# EAGLE design AX-03r (EAGLE 7.5.0)
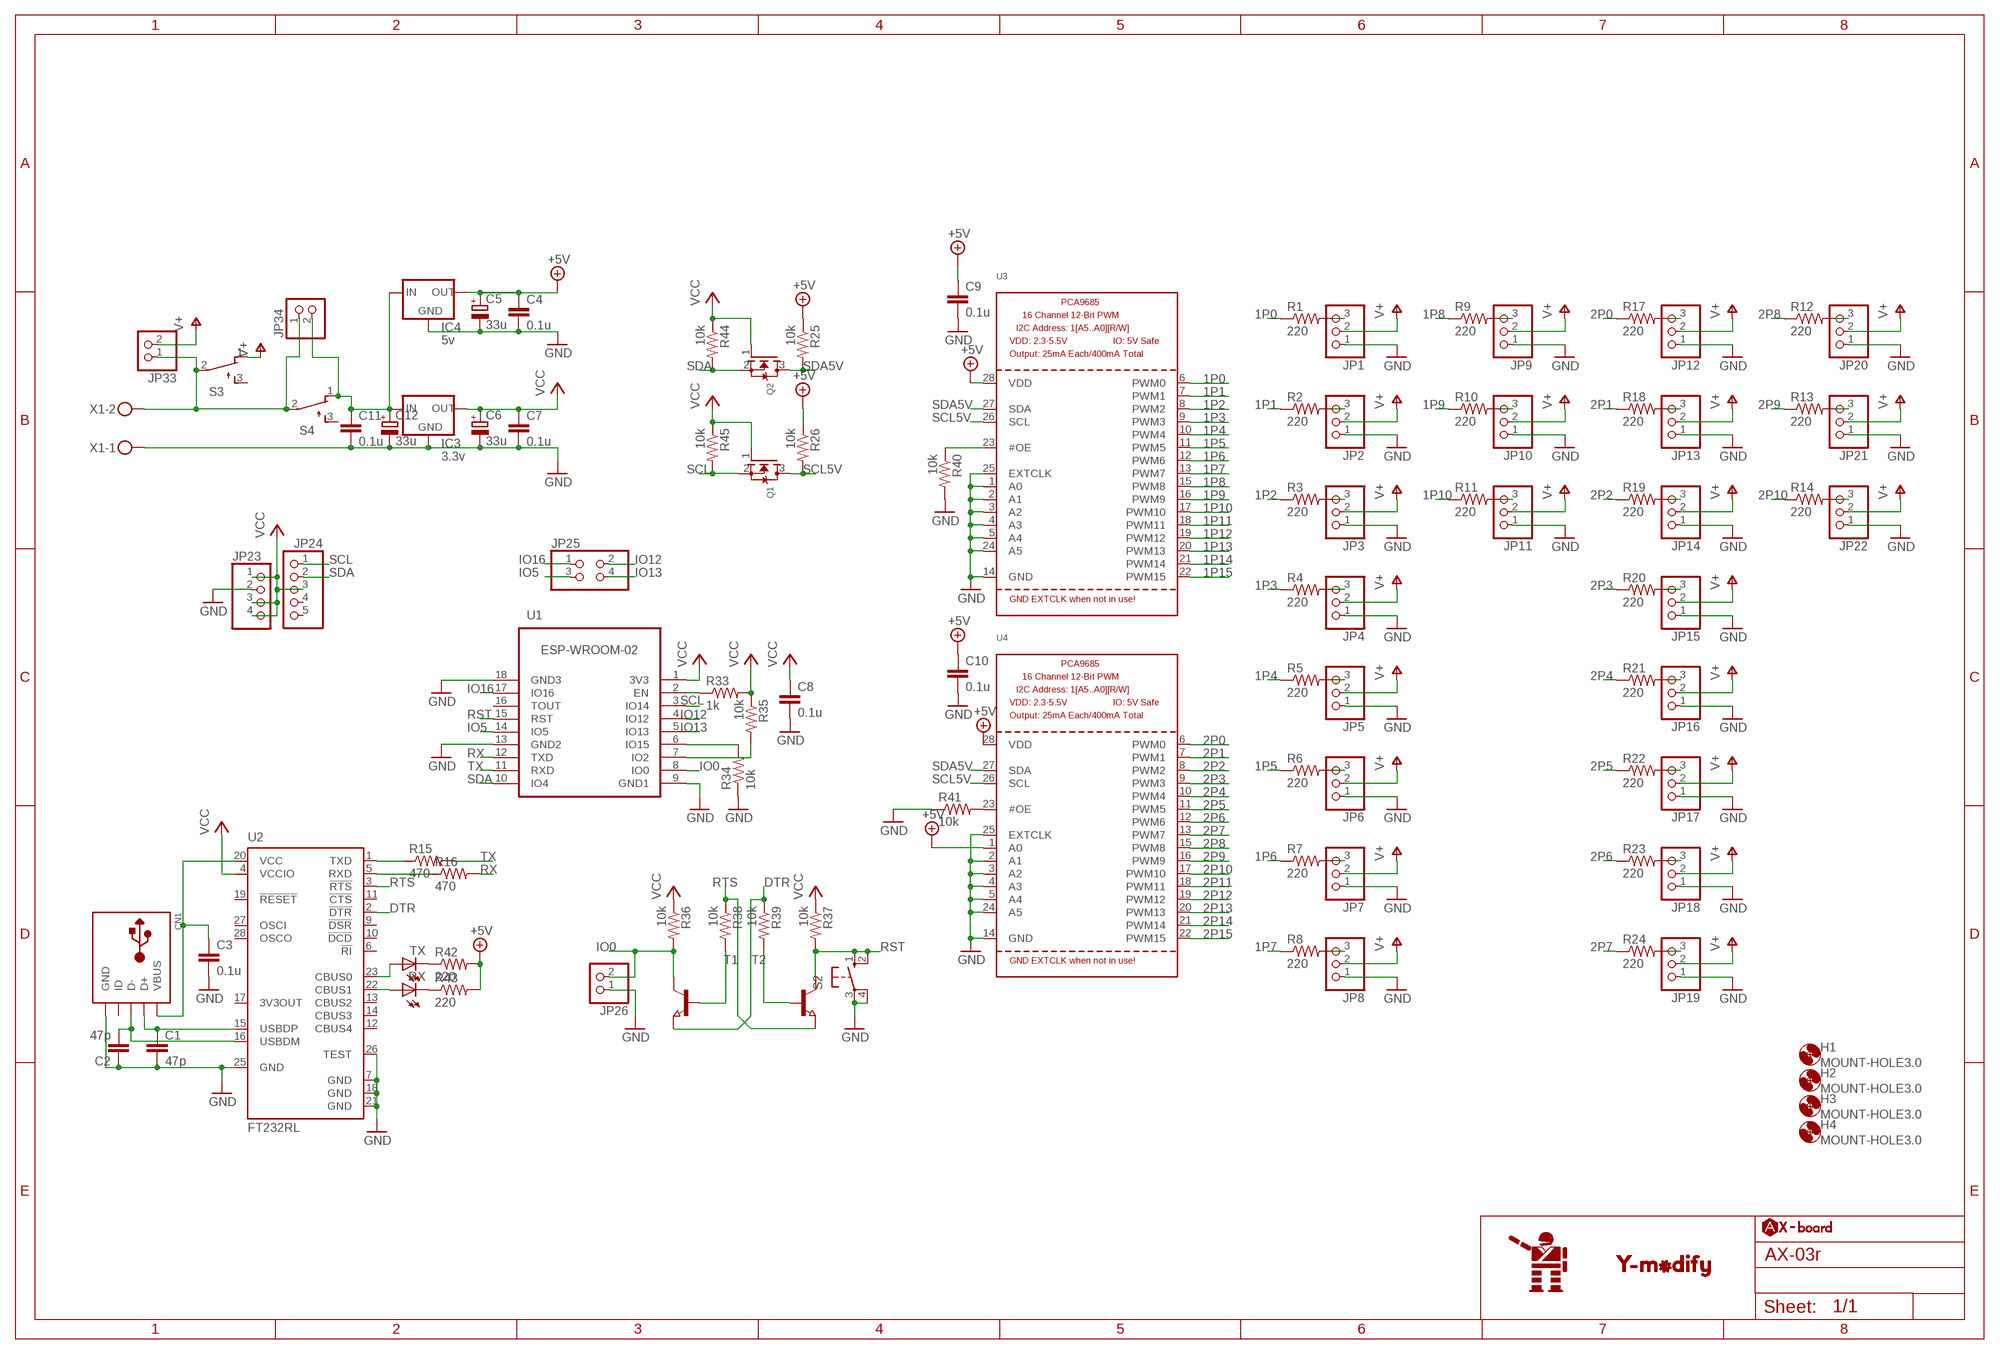
[diagram p0: schematic, sheet 1]

## Parts
C1  47p  C-EU025-025X050  [C025-025X050]
C2  47p  C-EU025-025X050  [C025-025X050]
C3  0.1u  C-EU025-025X050  [C025-025X050]
C4  0.1u  C-EU025-025X050  [C025-025X050]
C5  33u  CPOL-EUE2,5-6E  [E2,5-6E]
C6  33u  CPOL-EUE2,5-6E  [E2,5-6E]
C7  0.1u  C-EU025-025X050  [C025-025X050]
C8  0.1u  C-EU025-025X050  [C025-025X050]
C9  0.1u  C-EU025-025X050  [C025-025X050]
C10  0.1u  C-EU025-025X050  [C025-025X050]
C11  0.1u  C-EU025-025X050  [C025-025X050]
C12  33u  CPOL-EUE2,5-6E  [E2,5-6E]
CN1  USBTHM  [USB-MINIB-THM]
H1  MOUNT-HOLE3.0  [3,0]
H2  MOUNT-HOLE3.0  [3,0]
H3  MOUNT-HOLE3.0  [3,0]
H4  MOUNT-HOLE3.0  [3,0]
IC3  3.3v  78XXS  [78XXS]
IC4  5v  78XXS  [78XXS]
JP1  PINHD-1X3  [1X03]
JP2  PINHD-1X3  [1X03]
JP3  PINHD-1X3  [1X03]
JP4  PINHD-1X3  [1X03]
JP5  PINHD-1X3  [1X03]
JP6  PINHD-1X3  [1X03]
JP7  PINHD-1X3  [1X03]
JP8  PINHD-1X3  [1X03]
JP9  PINHD-1X3  [1X03]
JP10  PINHD-1X3  [1X03]
JP11  PINHD-1X3  [1X03]
JP12  PINHD-1X3  [1X03]
JP13  PINHD-1X3  [1X03]
JP14  PINHD-1X3  [1X03]
JP15  PINHD-1X3  [1X03]
JP16  PINHD-1X3  [1X03]
JP17  PINHD-1X3  [1X03]
JP18  PINHD-1X3  [1X03]
JP19  PINHD-1X3  [1X03]
JP20  PINHD-1X3  [1X03]
JP21  PINHD-1X3  [1X03]
JP22  PINHD-1X3  [1X03]
JP23  PINHD-1X4  [1X04]
JP24  PINHD-1X5  [1X05]
JP25  PINHD-2X2  [2X02]
JP26  PINHD-1X2  [1X02]
JP33  PINHD-1X2  [1X02]
JP34  PINHD-1X2  [1X02]
M1  MON  [MON]
M2  Y-MODIFY  [Y-MODIFY]
M3  AXBOARD  [AXBOARD]
Q1  MOSFET-NWAVE  [SOT23-W]
Q2  MOSFET-NWAVE  [SOT23-W]
R1  220  R-US_0204/2V  [0204V]
R2  220  R-US_0204/2V  [0204V]
R3  220  R-US_0204/2V  [0204V]
R4  220  R-US_0204/2V  [0204V]
R5  220  R-US_0204/2V  [0204V]
R6  220  R-US_0204/2V  [0204V]
R7  220  R-US_0204/2V  [0204V]
R8  220  R-US_0204/2V  [0204V]
R9  220  R-US_0204/2V  [0204V]
R10  220  R-US_0204/2V  [0204V]
R11  220  R-US_0204/2V  [0204V]
R12  220  R-US_0204/2V  [0204V]
R13  220  R-US_0204/2V  [0204V]
R14  220  R-US_0204/2V  [0204V]
R15  470  R-US_0204/2V  [0204V]
R16  470  R-US_0204/2V  [0204V]
R17  220  R-US_0204/2V  [0204V]
R18  220  R-US_0204/2V  [0204V]
R19  220  R-US_0204/2V  [0204V]
R20  220  R-US_0204/2V  [0204V]
R21  220  R-US_0204/2V  [0204V]
R22  220  R-US_0204/2V  [0204V]
R23  220  R-US_0204/2V  [0204V]
R24  220  R-US_0204/2V  [0204V]
R25  10k  R-US_0204/2V  [0204V]
R26  10k  R-US_0204/2V  [0204V]
R33  1k  R-US_0204/2V  [0204V]
R34  10k  R-US_0204/2V  [0204V]
R35  10k  R-US_0204/2V  [0204V]
R36  10k  R-US_0204/2V  [0204V]
R37  10k  R-US_0204/2V  [0204V]
R38  10k  R-US_0204/2V  [0204V]
R39  10k  R-US_0204/2V  [0204V]
R40  10k  R-US_0204/2V  [0204V]
R41  10k  R-US_0204/2V  [0204V]
R42  220  R-US_0204/2V  [0204V]
R43  220  R-US_0204/2V  [0204V]
R44  10k  R-US_0204/2V  [0204V]
R45  10k  R-US_0204/2V  [0204V]
RX  LED3MM  [LED3MM]
S2  10-XX  [B3F-10XX]
S3  TL32PO  [TL3XPO]
S4  TL32PO  [TL3XPO]
T1  NPN-TRANSISTOR_SOT23  [SOT23]
T2  NPN-TRANSISTOR_SOT23  [SOT23]
TX  LED3MM  [LED3MM]
U1  ESP-WROOM-02  ESP-WROOM-02FRONT-FACE  [FRONT-FACE]
U2  FT232RL  [SSOP28]
U3  PCA9685  [TSSOP28]
U4  PCA9685  [TSSOP28]
X1  MKDSN1,5/2-5,08  [MKDSN1,5/2-5,08]

## Nets
1P0: R1.1 U3.6(PWM0)
1P1: R2.1 U3.7(PWM1)
1P2: R3.1 U3.8(PWM2)
1P3: R4.1 U3.9(PWM3)
1P4: R5.1 U3.10(PWM4)
1P5: R6.1 U3.11(PWM5)
1P6: R7.1 U3.12(PWM6)
1P7: R8.1 U3.13(PWM7)
1P8: R9.1 U3.15(PWM8)
1P9: R10.1 U3.16(PWM9)
1P10: R11.1 U3.17(PWM10)
1P11: U3.18(PWM11)
1P12: U3.19(PWM12)
1P13: U3.20(PWM13)
1P14: U3.21(PWM14)
1P15: U3.22(PWM15)
2P0: R17.1 U4.6(PWM0)
2P1: R18.1 U4.7(PWM1)
2P2: R19.1 U4.8(PWM2)
2P3: R20.1 U4.9(PWM3)
2P4: R21.1 U4.10(PWM4)
2P5: R22.1 U4.11(PWM5)
2P6: R23.1 U4.12(PWM6)
2P7: R24.1 U4.13(PWM7)
2P8: R12.1 U4.15(PWM8)
2P9: R13.1 U4.16(PWM9)
2P10: R14.1 U4.17(PWM10)
2P11: U4.18(PWM11)
2P12: U4.19(PWM12)
2P13: U4.20(PWM13)
2P14: U4.21(PWM14)
2P15: U4.22(PWM15)
+5V: C4.1 C5.+ C9.1 C10.1 IC4.OUT R25.1 R26.1 R42.2 R43.2 U3.28(VDD) U4.1(A0) U4.28(VDD)
DTR: R39.1 T1.2(E) U2.2(!DTR)
GND: C1.2 C2.1 C3.2 C4.2 C5.- C6.- C7.2 C8.2 C9.2 C10.2 C11.2 C12.- CN1.GND IC3.GND IC4.GND JP1.1 JP2.1 JP3.1 JP4.1 JP5.1 JP6.1 JP7.1 JP8.1 JP9.1 JP10.1 JP11.1 JP12.1 JP13.1 JP14.1 JP15.1 JP16.1 JP17.1 JP18.1 JP19.1 JP20.1 JP21.1 JP22.1 JP23.2 JP26.1 R34.1 R40.2 R41.1 S2.3(P) S2.4(P1) U1.9(GND1) U1.13(GND2) U1.18(GND3) U2.7(GND) U2.18(GND) U2.21(GND) U2.25(GND) U2.26(TEST) U3.1(A0) U3.2(A1) U3.3(A2) U3.4(A3) U3.5(A4) U3.14(GND) U3.24(A5) U3.25(EXTCLK) U4.2(A1) U4.3(A2) U4.4(A3) U4.5(A4) U4.14(GND) U4.24(A5) U4.25(EXTCLK) X1.1
IO0: JP26.2 R36.2 T1.3(C) U1.8(IO0)
IO5: JP25.3 U1.14(IO5)
IO12: JP25.2 U1.4(IO12)
IO13: JP25.4 U1.5(IO13)
IO16: JP25.1 U1.17(IO16)
N$1: JP1.3 R1.2
N$2: R33.1 U1.2(EN)
N$3: JP2.3 R2.2
N$4: R34.2 U1.6(IO15)
N$5: JP3.3 R3.2
N$6: R35.2 U1.7(IO2)
N$7: JP4.3 R4.2
N$8: R41.2 U4.23(#OE)
N$9: JP5.3 R5.2
N$10: R40.1 U3.23(#OE)
N$11: JP6.3 R6.2
N$12: R38.2 T1.1(B)
N$13: JP7.3 R7.2
N$14: R39.2 T2.1(B)
N$15: JP8.3 R8.2
N$16: C1.1 CN1.D+ U2.15(USBDP)
N$17: JP9.3 R9.2
N$18: JP10.3 R10.2
N$19: JP11.3 R11.2
N$20: JP20.3 R12.2
N$21: JP21.3 R13.2
N$22: JP22.3 R14.2
N$25: C2.2 CN1.D- U2.16(USBDM)
N$26: JP12.3 R17.2
N$27: JP13.3 R18.2
N$28: JP14.3 R19.2
N$29: JP15.3 R20.2
N$30: JP16.3 R21.2
N$31: JP17.3 R22.2
N$32: JP18.3 R23.2
N$33: JP19.3 R24.2
N$34: C3.1 CN1.VBUS U2.20(VCC)
N$43: R42.1 TX.K(C)
N$44: R43.1 RX.K(C)
N$45: TX.A U2.23(CBUS0)
N$46: RX.A U2.22(CBUS1)
N$48: JP33.1 JP34.1 S3.2(P) S4.2(P) X1.2
N$49: C11.1 C12.+ IC3.IN IC4.IN JP34.2 S4.1(O)
N$50: R15.1 U2.1(TXD)
N$51: R16.1 U2.5(RXD)
RST: R37.2 S2.1(S) S2.2(S1) T2.3(C) U1.15(RST)
RTS: R38.1 T2.2(E) U2.3(!RTS)
RX: R16.2 U1.12(TXD)
SCL: JP24.1 Q1.2(S) R45.2 U1.3(IO14)
SCL5V: Q1.3(D) R26.2 U3.26(SCL) U4.26(SCL)
SDA: JP24.2 Q2.2(S) R44.2 U1.10(IO4)
SDA5V: Q2.3(D) R25.2 U3.27(SDA) U4.27(SDA)
TX: R15.2 U1.11(RXD)
V+: JP1.2 JP2.2 JP3.2 JP4.2 JP5.2 JP6.2 JP7.2 JP8.2 JP9.2 JP10.2 JP11.2 JP12.2 JP13.2 JP14.2 JP15.2 JP16.2 JP17.2 JP18.2 JP19.2 JP20.2 JP21.2 JP22.2 JP33.2 S3.1(O)
VCC: C6.+ C7.1 C8.1 IC3.OUT JP23.1 JP23.3 JP23.4 JP24.3 Q1.1(G) Q2.1(G) R33.2 R35.1 R36.1 R37.1 R44.1 R45.1 U1.1(3V3) U2.4(VCCIO)
Unconnected: CN1.ID JP24.4 JP24.5 S3.3(S) S4.3(S) U1.16(TOUT) U2.6(!RI) U2.9(!DSR) U2.10(!DCD) U2.11(!CTS) U2.12(CBUS4) U2.13(CBUS2) U2.14(CBUS3) U2.17(3V3OUT) U2.19(!RESET) U2.27(OSCI) U2.28(OSCO)

## Library data of the parts
C1-C4 C7-C11 = resistor:C-EU: CAPACITOR, European symbol
C5 C6 C12 = rcl:CPOL-EU: POLARIZED CAPACITOR, European symbol
CN1 = adafruit:USB: USB Connectors USBMINIB - Surface Mount Female Mini-B USB Connector 4UConnector: 06564 By microbuilder.eu Thru-hole RA Female Mini-B USB Connector 4UConnector: 18732 By ladyada.net
H1-H4 = holes:MOUNT-HOLE: MOUNTING HOLE with drill center marker
IC3 IC4 = v-reg:78XXS: VOLTAGE REGULATOR
JP1-JP22 = pinhead:PINHD-1X3: PIN HEADER
JP23 = pinhead:PINHD-1X4: PIN HEADER
JP24 = pinhead:PINHD-1X5: PIN HEADER
JP25 = pinhead:PINHD-2X2: PIN HEADER
JP26 JP33 JP34 = pinhead:PINHD-1X2: PIN HEADER
M1 = monchar:MON
M2 = y-modify_logo:Y-MODIFY
M3 = y-modify_logos:AXBOARD
Q1 Q2 = adafruit:MOSFET-N: N-Channel Mosfet 2N7002E - 60V 260mA SOT23 [Digikey: 2N7002ET1GOSTR-ND] - REEL BSH103 - 30V 850mA SOT23 [Digikey: 568-5013-1-ND]
R1-R26 R33-R45 = resistor:R-US_: RESISTOR, American symbol
RX TX = led:LED: LED OSRAM: - CHIPLED LG R971, LG N971, LY N971, LG Q971, LY Q971, LO R971, LY R971 LH N974, LH R974 LS Q976, LO Q976, LY Q976 LO Q996 - Hyper CHIPLED LW Q18S LB Q993, LB Q99A, LB R99A - SideLED LS A670, LO A670, LY A670, LG A670, LP A670 LB A673, LV A673, LT A673, LW A673 LH A674 LY A675 LS A676, LA A676, LO A676, LY A676, LW A676 LS A679, LY A679, LG A679 - Hyper Micro SIDELED® LS Y876, LA Y876, LO Y876, LY Y876 LT Y87S - SmartLED LW L88C, LW L88S LB L89C, LB L89S, LG L890 LS L89K, LO L89K, LY L89K LS L896, LA L896, LO L896, LY L896 - TOPLED LS T670, LO T670, LY T670, LG T670, LP T670 LSG T670, LSP T670, LSY T670, LOP T670, LYG T670 LG T671, LOG T671, LSG T671 LB T673, LV T673, LT T673, LW T673 LH T674 LS T676, LA T676, LO T676, LY T676, LB T676, LH T676, LSB T676, LW T676 LB T67C, LV T67C, LT T67C, LS T67K, LO T67K, LY T67K, LW E67C LS E67B, LA E67B, LO E67B, LY E67B, LB E67C, LV E67C, LT E67C LW T67C LS T679, LY T679, LG T679 LS T770, LO T770, LY T770, LG T770, LP T770 LB T773, LV T773, LT T773, LW T773 LH T774 LS E675, LA E675, LY E675, LS T675 LS T776, LA T776, LO T776, LY T776, LB T776 LHGB T686 LT T68C, LB T68C - Hyper Mini TOPLED® LB M676 - Mini TOPLED Santana® LG M470 LS M47K, LO M47K, LY M47K Source: http://www.osram.convergy.de LUXEON: - LUMILED® LXK2-PW12-R00, LXK2-PW12-S00, LXK2-PW14-U00, LXK2-PW14-V00 LXK2-PM12-R00, LXK2-PM12-S00, LXK2-PM14-U00 LXK2-PE12-Q00, LXK2-PE12-R00, LXK2-PE12-S00, LXK2-PE14-T00, LXK2-PE14-U00 LXK2-PB12-K00, LXK2-PB12-L00, LXK2-PB12-M00, LXK2-PB14-N00, LXK2-PB14-P00, LXK2-PB14-Q00 LXK2-PR12-L00, LXK2-PR12-M00, LXK2-PR14-Q00, LXK2-PR14-R00 LXK2-PD12-Q00, LXK2-PD12-R00, LXK2-PD12-S00 LXK2-PH12-R00, LXK2-PH12-S00 LXK2-PL12-P00, LXK2-PL12-Q00, LXK2-PL12-R00 Source: www.luxeon.com KINGBRIGHT: KA-3528ASYC Source: www.kingbright.com
S2 = switch-omron:10-XX: OMRON SWITCH; MPN: B3F-1000; OC_FARNELL: 176432; OC_NEWARK: 36M3542
S3 S4 = switch:TL32PO: TINY SWITCH ON - MOM Source: http://www2.produktinfo.conrad.com/datenblaetter/700000-724999/705152-da-01-de-Subminiaturschalter_TL_36YO.pdf
T1 T2 = semicon-smd-ipc:NPN-TRANSISTOR_: NPN TRANSISTOR
U1 = esp-wroom-02:ESP-WROOM-02: WiFi module - ESP-WROOM-02
U2 = ftdichip:FT232R: Source: http://www.ftdichip.com/Documents/DataSheets/DS_FT232R_v104.pdf; MPN: FT232RL; OC_FARNELL: 1146032; OC_NEWARK: 91K9918
U3 U4 = adafruit:PCA9685: PCA9685 - 16 Channel 12-Bit I2C PWM Controller 5.0V tolerant 16 channel, 12-bit I2C PWM controller with 25mA per output (max. 400mA total) Digikey: 568-5931-1-ND
X1 = con-phoenix-508:MKDSN1,5/2-5,08: MKDSN 1,5/ 2-5,08 Printklemme Nennstrom: 13,5 A Nennspannung: 250 V Rastermaß: 5,08 mm Polzahl: 2 Anschlussart: Schraubanschluss Montage: Löten Anschlussrichtung Leiter/Platine: 0 ° Artikelnummer: 1729128 Source: http://eshop.phoenixcontact.com .. 1729128.pdf

## Board
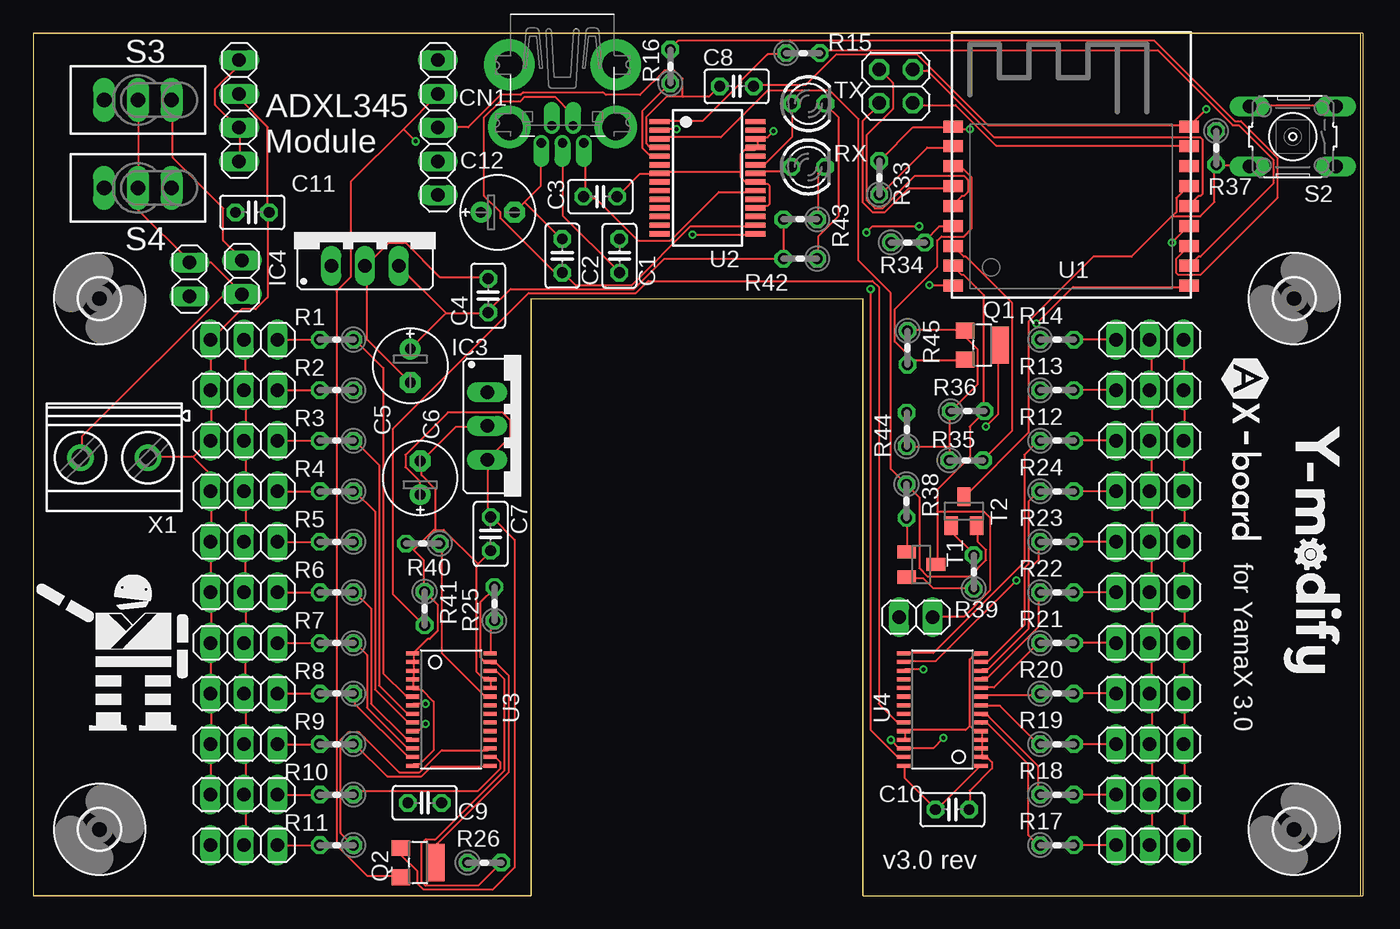
[diagram p1: board, top side]
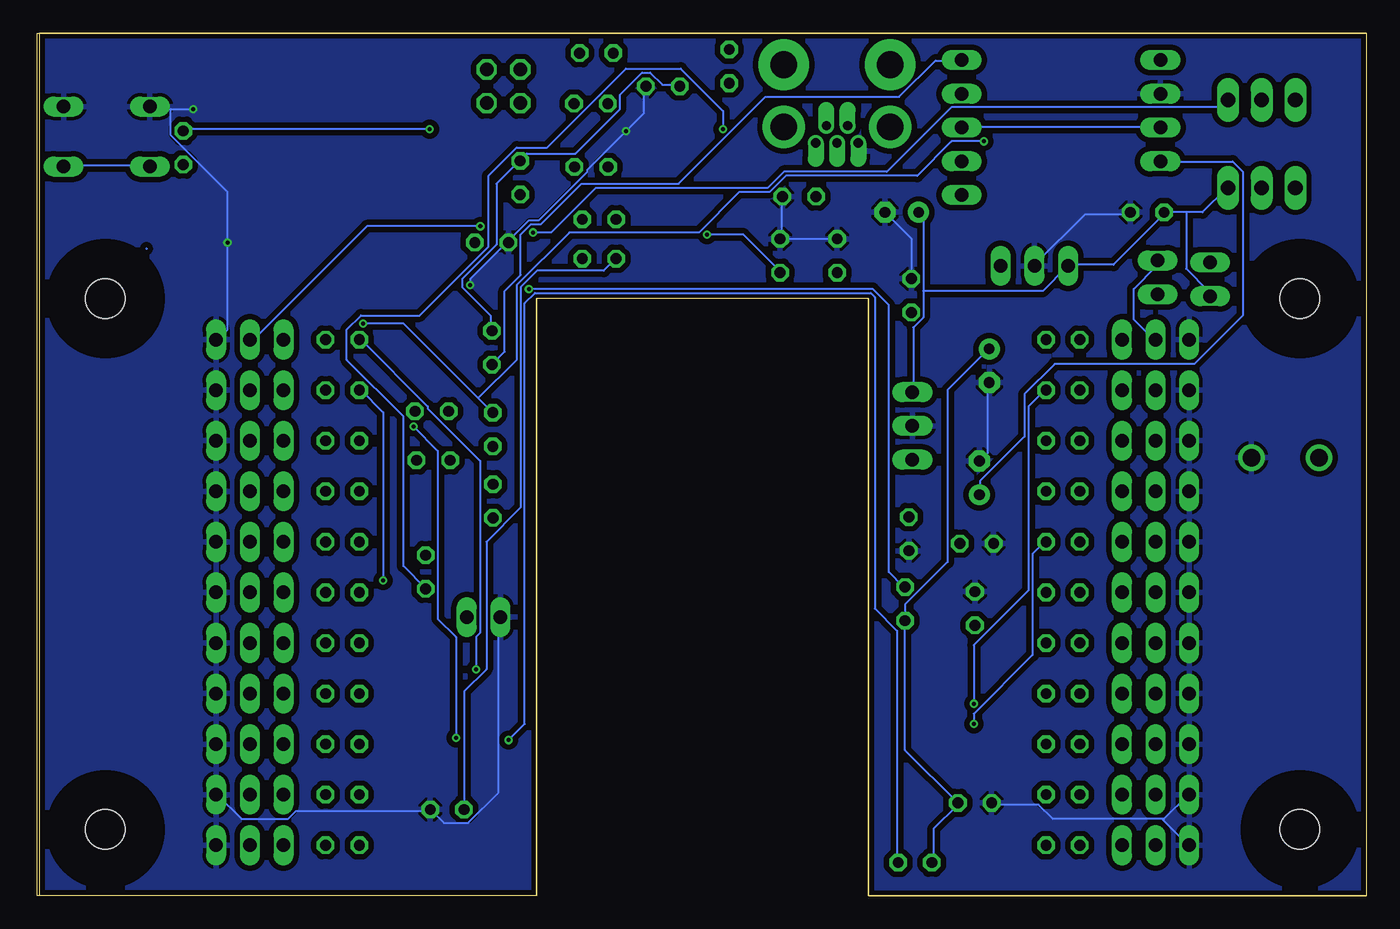
[diagram p2: board, bottom side, seen from below]

Size 100 x 65 mm. Coordinates in mm from the lower left corner, seen from the top.
Outline: 100,65 100,0 62.5,0 62.5,45 37.5,45 37.5,0 0,0 0,65 100,65
Copper layers (1*16): Top 0.035mm / dielectric 1.5mm / Bottom 0.035mm
Design rules "ssci_2layer": minimum track width 6mil, minimum drill 12mil, track to track 6mil, track to pad 6mil, pad to pad 6mil, via to via 6mil, smd to smd 0mil, copper to edge 10mil, drill to drill 10mil, minimum pad ring 10mil, minimum via ring 6mil, stop-mask expansion 2mil, vias tented up to drill 25mil, thermal gap 10mil
Milling: 8 lines

### Footprints (pad centres in the part's own frame; a part is rotated, then mirrored left to right if it is on the bottom)
C025-025X050 = drill 0.813 octagon: 1 -1.27,0; 2 1.27,0
E2,5-6E = drill 0.813 pad 1.575: + -1.27,0 | drill 0.813 pad 1.575 octagon: - 1.27,0
USB-MINIB-THM = drill 0.7 offset: D+ 0,9.8; D- -0.8,8.5; GND 1.6,9.8; ID 0.8,8.5; VBUS -1.6,9.8 | drill 2 pad 3.81: GND1 -4,3.9; GND4 4,3.9 | drill 2 pad 3.2: GND2 -4,8.6; GND3 4,8.6
3,0 = hole 3: 0,0
78XXS = drill 1.016 long: GND 0,-2.54; IN -2.54,-2.54; OUT 2.54,-2.54
1X03 = drill 1.016 long: 1 -2.54,0; 2 0,0; 3 2.54,0
1X04 = drill 1.016 long: 1 -3.81,0; 2 -1.27,0; 3 1.27,0; 4 3.81,0
1X05 = drill 1.016 long: 1 -5.08,0; 2 -2.54,0; 3 0,0; 4 2.54,0; 5 5.08,0
2X02 = drill 1.016 octagon: 1 -1.27,-1.27; 2 -1.27,1.27; 3 1.27,-1.27; 4 1.27,1.27
1X02 = drill 1.016 long: 1 -1.27,0; 2 1.27,0
SOT23-W = smd 1.2 x 1.4: 1 -1.1,-1.3; 2 1.1,-1.3 | smd 2.8 x 1.4: 3 0,1.3
0204V = drill 0.813 octagon: 1 -1.27,0; 2 1.27,0
LED3MM = drill 0.813 octagon: A -1.27,0; K 1.27,0
B3F-10XX = drill 1.016 long: 1 -3.251,2.261; 2 3.251,2.261; 3 -3.251,-2.261; 4 3.251,-2.261
TL3XPO = drill 1.1 pad 1.422 long: 1 -2.54,0; 2 0,0; 3 2.54,0
SOT23 = smd 1 x 1.4: 1 -0.95,-1.1; 2 0.95,-1.1; 3 0,1.1
FRONT-FACE = smd 1.485 x 0.9: 1 -8.893,4.9; 2 -8.893,3.4; 3 -8.893,1.9; 4 -8.893,0.4; 5 -8.893,-1.1; 6 -8.893,-2.6; 7 -8.893,-4.1; 8 -8.893,-5.6; 9 -8.893,-7.1; 10 8.893,-7.1; 11 8.893,-5.6; 12 8.893,-4.1; 13 8.893,-2.6; 14 8.893,-1.1; 15 8.893,0.4; 16 8.893,1.9; 17 8.893,3.4; 18 8.893,4.9
SSOP28 = smd 0.4 x 1.5: 1 -4.225,-3.625; 2 -3.575,-3.625; 3 -2.925,-3.625; 4 -2.275,-3.625; 5 -1.625,-3.625; 6 -0.975,-3.625; 7 -0.325,-3.625; 8 0.325,-3.625; 9 0.975,-3.625; 10 1.625,-3.625; 11 2.275,-3.625; 12 2.925,-3.625; 13 3.575,-3.625; 14 4.225,-3.625; 15 4.225,3.625; 16 3.575,3.625; 17 2.925,3.625; 18 2.275,3.625; 19 1.625,3.625; 20 0.975,3.625; 21 0.325,3.625; 22 -0.325,3.625; 23 -0.975,3.625; 24 -1.625,3.625; 25 -2.275,3.625; 26 -2.925,3.625; 27 -3.575,3.625; 28 -4.225,3.625
TSSOP28 = smd 0.305 x 0.991: 1 -4.225,-2.918; 2 -3.575,-2.918; 3 -2.925,-2.918; 4 -2.275,-2.918; 5 -1.625,-2.918; 6 -0.975,-2.918; 7 -0.325,-2.918; 8 0.325,-2.918; 9 0.975,-2.918; 10 1.625,-2.918; 11 2.275,-2.918; 12 2.925,-2.918; 13 3.575,-2.918; 14 4.225,-2.918; 15 4.225,2.918; 16 3.575,2.918; 17 2.925,2.918; 18 2.275,2.918; 19 1.625,2.918; 20 0.975,2.918; 21 0.325,2.918; 22 -0.325,2.918; 23 -0.975,2.918; 24 -1.625,2.918; 25 -2.275,2.918; 26 -2.925,2.918; 27 -3.575,2.918; 28 -4.225,2.918
MKDSN1,5/2-5,08 = drill 1.3 pad 2: 1 -2.561,0.025; 2 2.519,0.025

### Placement (x,y rotation side)
C1  44.17,48.22 90 top
C2  39.87,48.22 270 top
C3  42.72,52.69 0 top
C4  34.28,45.23 90 top
C5  28.41,39.94 270 top
C6  29.16,31.49 90 top
C7  34.46,27.27 270 top
C8  53,61 0 top
C9  29.5,7 180 top
C10  69.25,6.5 0 top
C11  16.5,51.5 0 top
C12  35,51.5 0 top
CN1  39.88,66.52 180 top
H1  95,5 0 top
H2  5,45 90 top
H3  5,5 0 top
H4  95,45 0 top
IC3  36.74,35.41 270 top
IC4  25,50 0 top
JP1  15.88,41.91 0 top
JP2  15.88,38.1 0 top
JP3  15.88,34.29 0 top
JP4  15.88,30.48 0 top
JP5  15.88,26.67 0 top
JP6  15.88,22.86 0 top
JP7  15.88,19.05 0 top
JP8  15.88,15.24 0 top
JP9  15.88,11.43 0 top
JP10  15.88,7.62 0 top
JP11  15.88,3.81 0 top
JP12  84.12,3.81 180 top
JP13  84.12,7.62 180 top
JP14  84.12,11.43 180 top
JP15  84.12,15.24 180 top
JP16  84.12,19.05 180 top
JP17  84.12,22.86 180 top
JP18  84.12,26.67 180 top
JP19  84.12,30.48 180 top
JP20  84.12,34.29 180 top
JP21  84.12,38.1 180 top
JP22  84.12,41.91 180 top
JP23  15.51,59.16 270 top
JP24  30.5,57.89 270 top
JP25  65,61 90 top
JP26  66.5,21 0 top
JP33  15.73,46.6 90 top
JP34  11.77,46.45 270 top
M1  0.25,12.45 0 top
M2  94.23,35.37 270 top
M3  89.5,40.5 270 top
Q1  71.5,41.5 270 top
Q2  29,2.5 270 top
R1  22.86,41.91 180 top
R2  22.86,38.1 180 top
R3  22.86,34.29 180 top
R4  22.86,30.48 180 top
R5  22.86,26.67 180 top
R6  22.86,22.86 180 top
R7  22.86,19.05 180 top
R8  22.86,15.24 180 top
R9  22.86,11.43 180 top
R10  22.86,7.62 180 top
R11  22.86,3.81 180 top
R12  77.14,34.29 0 top
R13  77.14,38.1 0 top
R14  77.14,41.91 0 top
R15  58,63.5 0 top
R16  48,62.5 90 top
R17  77.14,3.81 0 top
R18  77.14,7.62 0 top
R19  77.14,11.43 0 top
R20  77.14,15.24 0 top
R21  77.14,19.05 0 top
R22  77.14,22.86 0 top
R23  77.14,26.67 0 top
R24  77.14,30.48 0 top
R25  34.75,22 90 top
R26  34,2.5 0 top
R33  63.75,54.11 90 top
R34  65.89,49.23 0 top
R35  70.29,32.81 0 top
R36  70.4,36.51 0 top
R37  89.13,56.36 270 top
R38  65.79,29.74 270 top
R39  70.87,24.4 90 top
R40  29.35,26.54 180 top
R41  29.49,21.65 270 top
R42  57.79,48.01 180 top
R43  57.79,50.97 180 top
R44  65.81,35.13 90 top
R45  65.87,41.29 270 top
RX  58.39,54.92 0 top
S2  94.9,57.21 180 top
S3  7.89,59.96 180 top
S4  7.89,53.34 180 top
T1  66.91,24.96 270 top
T2  70.12,28.98 0 top
TX  58.42,59.69 0 top
U1  78.2,53.07 0 top
U2  50.8,54.11 270 top
U3  31.5,14.03 270 top
U4  68.5,14.03 90 top
X1  6.09,33.04 180 top

### Tracks (layer width: path | path; a pad name or v marks a point on that pad's centre or on a via)
1P0
  Top 0.152: U3.6 28.5,15.09 28.04,15.09 26.36,16.76 26.36,39.78 24.23,41.91 R1.1
1P1  (via drill 0.3)
  Top 0.152: v29.57,14.48 28.65,14.48 U3.7
  Bottom 0.152: v29.57,14.48 29.57,18.9 25.45,23.01 25.45,36.88 24.23,38.1 R2.1
1P2
  Top 0.152: U3.8 28.5,13.72 28.19,13.72 26.06,15.85 26.06,32.46 24.23,34.29 R3.1
1P3
  Top 0.152: U3.9 28.5,13.11 28.19,13.11 25.76,15.54 25.76,28.96 24.23,30.48 R4.1
1P4  (via drill 0.3)
  Top 0.152: v29.57,12.95 29.11,12.5 28.65,12.5 U3.10
  Bottom 0.152: v29.57,12.95 29.57,13.72 25.15,18.14 25.15,25.76 24.23,26.67 R5.1
1P5
  Top 0.152: U3.11 28.5,11.89 28.04,11.89 25.45,14.48 25.45,21.64 24.23,22.86 R6.1
1P6
  Top 0.152: U3.12 28.5,11.12 28.19,11.12 25.15,14.17 25.15,18.14 24.23,19.05 R7.1
1P7
  Top 0.152: U3.13 28.5,10.52 28.19,10.52 24.23,14.48 24.23,15.24 R8.1
1P8
  Top 0.152: U3.15 34.29,9.75 30.02,9.75 29.26,8.99 26.67,8.99 24.23,11.43 R9.1
1P9
  Top 0.152: U3.16 34.44,10.36 34.9,10.36 35.2,10.06 35.2,9.6 33.53,7.92 24.54,7.92 24.23,7.62 R10.1
1P10
  Top 0.152: U3.17 34.29,10.97 30.79,10.97 29.11,9.3 27.58,9.3 24.54,12.34 23.77,12.34 23.16,11.73 23.16,4.72 24.08,3.81 R11.1
2P0
  Top 0.152: U4.6 71.48,12.95 71.93,12.95 74.98,9.91 74.98,4.57 75.74,3.81 R17.1
2P1
  Top 0.152: U4.7 71.48,13.56 71.93,13.56 75.74,9.75 75.74,7.62 R18.1
2P2
  Top 0.152: U4.8 71.48,14.33 72.85,14.33 75.74,11.43 R19.1
2P3
  Top 0.152: U4.9 71.48,15.09 75.59,15.09 75.74,15.24 R20.1
2P4
  Top 0.152: U4.10 71.48,15.7 72.39,15.7 75.74,19.05 R21.1
2P5
  Top 0.152: U4.11 71.48,16.46 71.93,16.46 75.74,20.27 75.74,22.86 R22.1
2P6
  Top 0.152: U4.12 71.48,17.07 71.93,17.07 74.98,20.12 74.98,24.54 75.74,25.3 75.74,26.67 R23.1
2P7
  Top 0.152: U4.13 71.48,17.68 71.93,17.68 74.68,20.42 74.68,24.69 74.98,24.99 74.98,29.72 75.74,30.48 R24.1
2P8
  Top 0.152: U4.15 65.68,18.29 67.82,18.29 74.68,25.15 74.68,33.22 75.74,34.29 R12.1
2P9  (via drill 0.3)
  Top 0.152: v74.07,23.77 67.97,17.68 65.68,17.68 U4.16
  Bottom 0.152: v74.07,23.77 74.07,36.42 75.74,38.1 R13.1
2P10  (via drill 0.3)
  Top 0.152: v67.06,17.07 65.68,17.07 U4.17
  Bottom 0.152: v67.06,17.07 67.06,19.51 66.75,19.81 66.75,32.77 70.71,36.73 70.71,36.88 75.74,41.91 R14.1
+5V
  Top 0.152: U3.28 34.44,18.29 34.44,20.42 R25.1 | U4.28 65.68,9.75 65.68,8.84 67.97,6.55 C10.1 68.12,6.55 71.32,9.75 U4.1 | R43.2 56.54,50.9 56.54,48.16 R42.2 56.39,48.01 47.55,48.01 45.26,45.72 35.97,45.72 34.29,44.04 C4.1 34.14,43.89 31.09,43.89 | 31.09,43.89 28.5,41.3 C5.+ | 31.09,43.89 27.58,47.4 IC4.OUT
  Bottom 0.152: R26.1 32.61,2.59 32.61,5.03 30.79,6.86 C9.1 30.79,7.01 34.75,10.97 R25.1 34.75,20.88 34.75,21.95 31.55,25.15 31.55,38.1 28.5,41.15 C5.+ | C10.1 67.97,6.55 67.97,15.39 66.29,17.07 66.29,26.67 63.7,29.26 63.7,45.87 62.48,47.09 57.45,47.09 56.54,48.01 R42.2
DTR  (via drill 0.3)
  Top 0.152: T1.2 65.84,23.93 67.06,23.93 67.82,23.16 70.87,23.16 R39.1 | v48.46,57.76 47.24,57.76 U2.2
  Bottom 0.152: v48.46,57.76 48.46,59.13 51.66,62.33 55.78,62.33 61.72,56.39 64.01,56.39 66.14,54.25 66.14,48.92 71.32,43.74 75.74,43.74 76.81,42.67 76.81,40.39 72.54,36.12 72.54,24.84 70.87,23.16 R39.1
GND  (via drill 0.3)
  Top 0.152: U4.25 65.68,11.89 65.68,12.34 U4.24 65.68,12.5 70.26,12.5 70.56,12.8 | 70.56,12.8 70.56,17.83 70.87,18.14 71.32,18.14 U4.14 | 70.56,12.8 70.87,12.5 71.32,12.5 U4.5 71.48,12.34 71.48,11.89 U4.4 71.48,11.73 71.48,11.12 U4.3 71.48,10.97 71.48,10.52 U4.2 71.48,10.36 71.93,10.36 72.24,10.06 72.24,9.6 70.56,7.92 70.56,6.55 C10.2 | v88.39,59.28 87.17,58.06 U1.18 87.02,58.06 71.93,58.06 66.6,63.4 60.5,63.4 58.22,61.11 54.41,61.11 C8.2 | S2.3 98.15,59.59 91.75,59.59 S2.4 | v85.8,49.23 87.02,50.44 U1.13 | 86.72,38.1 86.72,34.29 | 86.72,30.48 86.72,26.67 | 86.72,22.86 86.72,19.05 | 86.72,7.62 86.72,3.81 JP12.1 | 86.72,15.24 86.72,11.43 | 86.72,11.43 86.72,7.62 | 86.72,7.62 JP13.1 | 86.72,11.43 JP14.1 | 86.72,15.24 86.72,19.05 | 86.72,19.05 JP16.1 | 86.72,15.24 JP15.1 | 86.72,22.86 86.72,26.67 | 86.72,26.67 JP18.1 | 86.72,22.86 JP17.1 | 86.72,30.48 86.72,34.29 | 86.72,34.29 JP20.1 | 86.72,30.48 JP19.1 | 86.72,38.1 86.72,41.91 JP22.1 | 86.72,38.1 JP21.1 | 13.41,26.67 13.41,30.48 JP4.1 13.26,30.48 13.26,31.85 12.04,33.07 | 13.41,38.1 13.41,34.29 JP3.1 13.26,34.29 12.04,33.07 | 13.41,38.1 13.41,41.91 | 13.41,38.1 JP2.1 | 12.04,33.07 8.69,33.07 X1.1 | 13.41,22.86 13.41,19.05 | 13.41,15.24 13.41,11.43 | 13.41,11.43 13.41,7.62 JP10.1 | 13.41,11.43 JP9.1 | 13.41,15.24 13.41,19.05 | 13.41,19.05 JP7.1 | 13.41,15.24 JP8.1 | 13.41,22.86 13.41,26.67 | 13.41,26.67 JP5.1 | 13.41,22.86 JP6.1 | v67.51,46.02 69.19,46.02 U1.9 | 37.03,52.27 36.27,51.51 C12.- | 37.03,52.27 38.25,53.49 38.25,56.69 CN1.GND | 37.03,52.27 39.78,49.53 C2.1 | U2.18 54.56,51.97 55.32,51.97 55.47,52.12 55.47,53.49 55.32,53.65 54.56,53.65 U2.21 54.41,53.8 53.65,53.8 53.34,54.1 53.34,54.56
  Top 0.152: 53.34,54.56 53.34,55.93 53.65,56.24 54.41,56.24 U2.25 54.56,56.39 54.56,57 U2.26 54.56,57.15 55.32,57.15 v55.78,57.61 | C3.2 44.04,52.73 45.72,54.41 47.09,54.41 U2.7 47.24,54.56 53.34,54.56 | JP23.2 15.54,60.35 15.54,60.05 17.68,57.91 17.68,51.51 C11.2 17.68,51.36 17.68,45.11 16.76,44.2 15.7,44.2 13.41,41.91 | IC3.GND 34.14,35.36 31.85,35.36 29.26,32.77 C6.- 29.26,32.61 29.26,31.7 30.33,30.63 30.33,27.58 | U3.24 34.44,15.7 34.44,16.31 U3.25 34.29,16.46 33.83,16.46 33.38,16.92 33.38,24.84 33.53,24.99 | 33.53,24.99 34.44,25.91 C7.2 | U3.14 28.65,9.91 29.11,9.91 30.18,10.97 30.18,14.63 29.26,15.54 28.65,15.54 U3.5 28.65,15.7 28.65,16.31 U3.4 28.65,16.46 28.65,16.92 U3.3 28.65,17.07 28.65,17.53 U3.2 28.65,17.68 28.65,18.14 U3.1 28.65,18.29 29.72,19.36 29.87,19.36 30.48,19.96 30.48,21.95 29.57,22.86 R41.1 29.41,23.01 29.41,25.3 28.65,26.06 | 28.65,26.06 28.19,26.52 R40.2 | 33.53,24.99 30.94,27.58 30.33,27.58 | 30.33,27.58 30.18,27.58 28.65,26.06 | C5.- 28.35,38.71 25.15,41.91 25.15,47.4 IC4.GND 25.15,47.55 26.82,49.23 28.04,49.23 30.63,46.63 34.14,46.63 C4.2 | 13.41,41.91 JP1.1
  Bottom 0.152: JP26.1 65.38,20.88 65.38,7.77 67.67,5.49 69.49,5.49 70.41,6.4 C10.2 70.56,6.4 80.62,6.4 81.23,5.79 84.73,5.79 86.56,7.62 JP13.1 | 90.07,59.28 91.44,59.28 91.59,59.44 S2.4 | 90.07,59.28 v88.39,59.28 | JP22.1 86.56,41.91 85.8,42.67 v85.8,49.23 85.8,53.03 90.07,57.3 90.07,59.28 | 15.39,5.79 15.24,5.79 13.41,7.62 JP10.1 | 15.39,5.79 23.62,5.79 24.69,6.86 28.19,6.86 C9.2 | 15.39,5.79 13.41,3.81 JP11.1 | v67.51,46.02 67.51,46.48 64.77,49.23 R34.1 64.62,49.38 63.09,50.9 62.33,50.9 58.67,54.56 58.67,54.71 v55.78,57.61 54.41,58.98 54.41,60.96 C8.2 | C4.2 34.29,46.63 34.29,49.53 36.12,51.36 C12.- | 44.04,49.53 44.04,52.58 C3.2 | 44.04,49.53 39.93,49.53 C2.1 | 44.04,49.53 C1.2 | C11.2 17.83,51.36 21.18,51.36 24.99,47.55 IC4.GND | C5.- 28.5,38.56 28.5,33.38 29.11,32.77 C6.-
  pour Bottom (isolate 0.406): 0,65 100,65 100,0 62.5,0 62.5,45 37.5,45 37.5,0 0,0
IO0
  Top 0.152: 68.12,28.96 68.12,30.63 70.56,33.07 70.56,35.36 71.63,36.42 R36.2 71.63,36.58 71.63,45.26 70.1,46.79 69.95,46.79 69.34,47.4 U1.8 | 68.12,28.96 68.12,24.99 T1.3 | 68.12,28.96 71.63,28.96 72.08,28.5 72.08,23.01 70.1,21.03 67.82,21.03 JP26.2
IO5
  Top 0.152: U1.14 87.17,52.12 87.78,52.73 87.94,52.73 88.09,52.88 88.09,57 87.94,57.15 72.39,57.15 67.36,62.18 66.29,62.18 JP25.3
IO12
  Top 0.152: U1.4 69.19,53.34 65.99,53.34 64.16,51.51 63.25,51.51 62.48,52.27 62.48,58.37 63.7,59.59 JP25.2
IO13
  Top 0.152: U1.5 69.34,52.12 69.95,52.73 70.1,52.73 70.41,53.03 70.41,53.95 70.1,54.25 66.45,54.25 64.01,51.82 63.4,51.82 62.79,52.43 62.79,57.3 64.77,59.28 64.77,61.27 63.86,62.18 JP25.4
IO16
  Top 0.152: U1.17 87.02,56.54 72.54,56.54 69.49,59.59 66.29,59.59 JP25.1
N$1
  Top 0.152: JP1.3 R1.2
N$2
  Top 0.152: U1.2 69.19,56.39 67.36,56.39 63.86,52.88 R33.1
N$3
  Top 0.152: JP2.3 R2.2
N$4
  Top 0.152: U1.6 69.19,50.44 68.28,50.44 67.21,49.38 R34.2
N$5
  Top 0.152: JP3.3 R3.2
N$6
  Top 0.152: U1.7 69.34,48.92 70.1,48.16 70.26,48.16 73.76,44.65 73.76,35.05 71.63,32.92 R35.2
N$7
  Top 0.152: JP4.3 R4.2
N$8
  Top 0.152: U4.23 65.53,13.11 65.08,13.11 63.7,14.48 63.7,45.87 63.25,46.33 46.33,46.33 45.41,45.41 37.34,45.41 27.13,35.2 27.13,22.71 29.41,20.42 R41.2
N$9
  Top 0.152: JP5.3 R5.2
N$10
  Top 0.152: U3.23 34.29,15.09 33.98,15.09 30.79,18.29 30.79,26.36 30.63,26.52 R40.1
N$11
  Top 0.152: JP6.3 R6.2
N$12
  Top 0.152: T1.1 65.84,26.06 65.84,28.35 R38.2
N$13
  Top 0.152: JP7.3 R7.2
N$14
  Top 0.152: T2.1 69.19,27.74 69.19,27.43 70.87,25.76 R39.2
N$15
  Top 0.152: JP8.3 R8.2
N$16  (via drill 0.3)
  Top 0.152: v49.68,49.84 54.41,49.84 U2.15 | CN1.D+ 39.93,56.69 39.93,51.21 44.04,47.09 C1.1
  Bottom 0.152: v49.68,49.84 46.94,49.84 44.2,47.09 C1.1
N$17
  Top 0.152: JP9.3 R9.2
N$18
  Top 0.152: JP10.3 R10.2
N$19
  Top 0.152: JP11.3 R11.2
N$20
  Top 0.152: JP20.3 R12.2
N$21
  Top 0.152: JP21.3 R13.2
N$22
  Top 0.152: JP22.3 R14.2
N$23
  Bottom 0.152: 91.9,48.77 91.9,48.74
N$25
  Top 0.152: U2.16 54.41,50.44 49.53,50.44 45.11,46.02 40.84,46.02 39.93,46.94 C2.2 39.78,47.09 39.17,47.09 35.2,51.05 35.2,51.51 33.98,52.73 33.98,58.67 35.2,59.89 36.73,59.89 37.03,60.2 39.32,60.2 40.54,58.98 40.54,58.06 CN1.D-
N$26
  Top 0.152: JP12.3 R17.2
N$27
  Top 0.152: JP13.3 R18.2
N$28
  Top 0.152: JP14.3 R19.2
N$29
  Top 0.152: JP15.3 R20.2
N$30
  Top 0.152: JP16.3 R21.2
N$31
  Top 0.152: JP17.3 R22.2
N$32
  Top 0.152: JP18.3 R23.2
N$33
  Top 0.152: JP19.3 R24.2
N$34
  Top 0.152: U2.20 54.41,53.03 51.66,53.03 48.01,49.38 45.57,49.38 42.37,52.58 41.6,52.58 C3.1 41.6,52.73 41.6,56.69 CN1.VBUS
N$43
  Top 0.152: R42.1 59.13,48.16 59.13,49.68 60.66,51.21 60.66,58.67 59.74,59.59 TX.K
N$44
  Top 0.152: R43.1 59.13,51.05 59.13,54.41 59.59,54.86 RX.K
N$45
  Top 0.152: TX.A 57.15,57.15 55.17,55.17 54.56,55.17 U2.23
N$46
  Top 0.152: U2.22 54.56,54.56 56.69,54.56 57,54.86 RX.A
N$48
  Top 0.152: 7.92,53.34 7.92,59.89 S3.2 | 15.09,46.02 15.7,45.41 JP33.1 15.09,46.02 | 15.09,46.02 13.41,47.7 11.89,47.7 JP34.1 11.73,47.85 7.92,51.66 7.92,53.34 | 15.09,46.02 3.66,34.59 3.66,33.07 X1.2 | 7.92,53.34 S4.2
N$49
  Bottom 0.152: 33.38,45.57 33.38,51.05 33.68,51.36 C12.+ | 33.38,45.57 33.38,43.59 34.14,42.82 34.14,38.1 IC3.IN | 13.56,51.51 12.34,51.51 10.52,53.34 S4.1 | 13.56,51.51 15.09,51.51 C11.1 15.24,51.36 19.05,47.55 22.4,47.55 IC4.IN 22.55,47.4 24.38,45.57 33.38,45.57 | 13.56,51.51 13.56,47.24 11.89,45.57 11.89,45.26 JP34.2
N$50
  Top 0.152: U2.1 47.24,58.37 50.44,58.37 53.34,61.27 53.34,61.42 55.32,63.4 56.69,63.4 R15.1
N$51
  Top 0.152: U2.5 47.09,55.78 46.48,55.78 45.87,56.39 45.87,59.13 47.85,61.11 R16.1
RST
  Top 0.152: S2.2 91.59,55.02 89.15,55.02 R37.2 89,55.02 89,52.27 87.94,51.21 85.8,51.21 | 85.8,51.21 86.11,51.51 86.11,52.58 87.02,53.49 U1.15 | 85.8,51.21 82.75,48.16 79.86,48.16 74.98,43.28 74.98,34.9 70.26,30.18 T2.3
  Bottom 0.152: S2.1 98.15,55.02 91.75,55.02 S2.2
RTS
  Top 0.152: T2.2 71.17,27.74 71.17,26.67 71.78,26.06 71.78,25.3 70.56,24.08 67.36,24.08 66.75,24.69 66.75,30.02 65.84,30.94 R38.1 65.68,31.09 64.62,32.16 64.62,45.41 62.18,47.85 62.18,58.52 60.05,60.66 55.32,60.66 51.82,57.15 47.24,57.15 U2.3
RX
  Top 0.152: U1.12 87.02,48.92 86.11,48.01 86.11,46.94 86.26,46.79 87.94,46.79 93.73,52.58 93.73,55.63 90.98,58.37 90.53,58.37 84.43,64.47 48.62,64.47 48.01,63.86 R16.2
SCL
  Top 0.152: 66.29,40.39 70.1,40.39 Q1.2 | 66.29,40.39 65.99,40.08 R45.2 66.29,40.39 | 66.29,40.39 64.92,41.76 64.92,44.2 68.12,47.4 68.12,49.38 68.43,49.68 70.1,49.68 70.71,50.29 70.71,54.1 69.95,54.86 69.34,54.86 U1.3
  Bottom 0.152: JP24.1 30.63,62.94 32.46,62.94 35.2,60.2 45.26,60.2 51.82,53.65 59.13,53.65 62.18,50.6 62.94,50.6 63.7,49.84 63.7,46.79 64.92,45.57 64.92,41 65.84,40.08 R45.2
SCL5V  (via drill 0.3)
  Top 0.152: U3.26 34.44,16.92 34.9,16.92 35.51,16.31 35.51,9.45 30.33,4.27 29.57,4.27 29.26,3.96 29.26,1.07 29.57,0.76 33.53,0.76 35.2,2.44 R26.2 | v68.58,11.89 67.82,11.12 65.68,11.12 U4.26 65.53,11.12 65.23,11.12 v64.62,11.73 | v71.78,35.36 72.69,36.27 72.69,41.45 Q1.3
  Bottom 0.152: v68.58,11.89 68.58,19.51 69.95,20.88 69.95,33.53 v71.78,35.36 | v64.62,11.73 63.4,12.95 63.4,44.65 62.64,45.41 37.34,45.41 37.03,45.11 37.03,21.64 35.36,19.96 35.36,2.59 R26.2
SDA  (via drill 0.3)
  Top 0.152: v75.59,43.13 78.33,45.87 87.02,45.87 U1.10 | 27.89,57.76 30.48,60.35 JP24.2 | 27.89,57.76 23.93,53.8 23.93,46.63 22.86,45.57 22.86,3.81 25.15,1.52 27.58,1.52 Q2.2 | 27.89,57.76 v28.8,56.84
  Bottom 0.152: v75.59,43.13 72.54,43.13 66.9,37.49 | 66.9,37.49 65.84,36.42 R44.2 | 66.9,37.49 64.01,40.39 64.01,46.02 60.05,49.99 50.29,49.99 47.24,53.03 44.96,53.03 43.74,54.25 33.83,54.25 31.24,56.84 v28.8,56.84
SDA5V  (via drill 0.3)
  Top 0.152: R25.2 34.75,23.16 33.68,22.1 33.68,17.98 33.98,17.68 34.29,17.68 U3.27 34.44,17.53 34.9,17.53 35.81,16.61 35.81,9.3 30.33,3.81 30.33,2.59 Q2.3 | v63.09,45.72 63.09,12.5 65.08,10.52 65.53,10.52 U4.27
  Bottom 0.152: v63.09,45.72 37.19,45.72 35.97,44.5 35.97,24.38 34.9,23.32 R25.2
TX
  Top 0.152: U1.11 87.17,47.55 87.78,48.16 87.94,48.16 93.42,53.65 93.42,55.47 90.83,58.06 90.37,58.06 84.73,63.7 59.44,63.7 59.28,63.55 R15.2
V+  (via drill 0.3)
  Top 0.152: 84.28,38.1 84.28,34.29 | 84.28,38.1 84.28,41.91 JP22.2 | 84.28,38.1 JP21.2 | 84.28,30.48 84.28,26.67 | 84.28,22.86 84.28,19.05 | 84.28,7.62 84.28,3.81 JP12.2 | 84.28,15.24 84.28,11.43 | 84.28,11.43 84.28,7.62 | 84.28,7.62 JP13.2 | 84.28,11.43 JP14.2 | 84.28,15.24 84.28,19.05 | 84.28,19.05 JP16.2 | 84.28,15.24 JP15.2 | 84.28,22.86 84.28,26.67 | 84.28,26.67 JP18.2 | 84.28,22.86 JP17.2 | 84.28,30.48 84.28,34.29 | 84.28,34.29 JP20.2 | 84.28,30.48 JP19.2 | 16,30.48 16,26.67 | 16,22.86 16,19.05 | 16,7.62 16,3.81 JP11.2 | 16,15.24 16,11.43 | 16,11.43 16,7.62 | 16,7.62 JP10.2 | 16,11.43 JP9.2 | 16,15.24 16,19.05 | 16,19.05 JP7.2 | 16,15.24 JP8.2 | 16,22.86 16,26.67 | 16,26.67 JP5.2 | 16,22.86 JP6.2 | 16,38.1 16,34.29 | 16,38.1 16,41.91 JP1.2 | 16,38.1 JP2.2 | S3.1 10.52,59.89 10.52,55.63 14.33,51.82 14.33,49.38 15.7,48.01 JP33.2 | 16,34.29 16,30.48 | 16,30.48 JP4.2 | 16,34.29 JP3.2 | v66.75,50.44 63.25,50.44 v62.79,49.99
  Bottom 0.152: JP33.2 15.85,47.85 15.85,47.4 17.53,45.72 17.53,43.43 16,41.91 JP1.2 | JP22.2 83.82,41.91 75.29,50.44 v66.75,50.44 | v62.79,49.99 61.42,49.99 58.06,53.34 45.11,53.34 43.89,54.56 36.12,54.56 31.24,59.44 10.97,59.44 10.52,59.89 S3.1
VCC  (via drill 0.3)
  Top 0.152: Q2.1 27.74,3.5 27.74,3.05 28.96,1.83 28.96,0.91 29.41,0.46 34.59,0.46 36.27,2.13 36.27,26.82 34.59,28.5 C7.1 34.44,28.65 34.29,28.8 34.29,32.77 IC3.OUT 34.29,32.92 35.97,34.59 35.97,35.81 35.36,36.42 31.24,36.42 28.04,33.22 28.04,32.31 29.11,31.24 29.11,30.33 C6.+ | JP23.4 15.54,55.47 15.54,57.76 JP23.3 15.39,57.91 13.72,59.59 13.72,60.81 15.39,62.48 15.39,62.94 JP23.1 | R45.1 65.99,42.67 70.1,42.67 Q1.1 70.26,42.52 70.26,42.06 71.17,41.15 71.17,38.56 69.19,36.58 R36.1 69.04,36.42 69.04,33.83 | 69.04,33.83 69.04,32.92 R35.1 | 69.04,33.83 65.84,33.83 R44.1 | 48.92,60.2 50.9,60.2 51.66,60.96 C8.1 | 48.92,60.2 47.7,60.2 46.18,58.67 46.18,56.69 46.48,56.39 47.09,56.39 U2.4 | R33.2 63.86,55.47 66.29,57.91 69.19,57.91 U1.1 69.34,57.91 69.49,57.76 v70.56,57.76 | 48.92,60.2 48.92,61.57 48.31,62.18 47.55,62.18 45.72,60.35 43.13,60.35 42.98,60.5 36.88,60.5 36.73,60.35 35.2,60.35 32.77,57.91 30.63,57.91 JP24.3
  Bottom 0.152: JP24.3 30.48,57.91 15.54,57.91 JP23.3 | v70.56,57.76 89,57.76 R37.1 | C8.1 51.82,61.11 53.03,61.11 53.95,62.03 54.56,62.03 56.24,60.35 56.24,59.28 59.59,55.93 63.25,55.93 63.7,55.47 R33.2 63.86,55.32 65.53,53.65 65.53,49.07 68.12,46.48 68.12,45.87 65.99,43.74 65.99,42.67 R45.1 | C6.+ 29.11,30.33 29.11,31.24 25.76,34.59 25.76,37.8 23.47,40.08 12.95,40.08 9.3,43.74 9.3,54.56 10.06,55.32 15.39,55.32 JP23.4

### Text on the board
tPlace: ADXL345 / Module | for YamaX 3.0 | v3.0 rev